# Altium project MSWC.PrjPcb
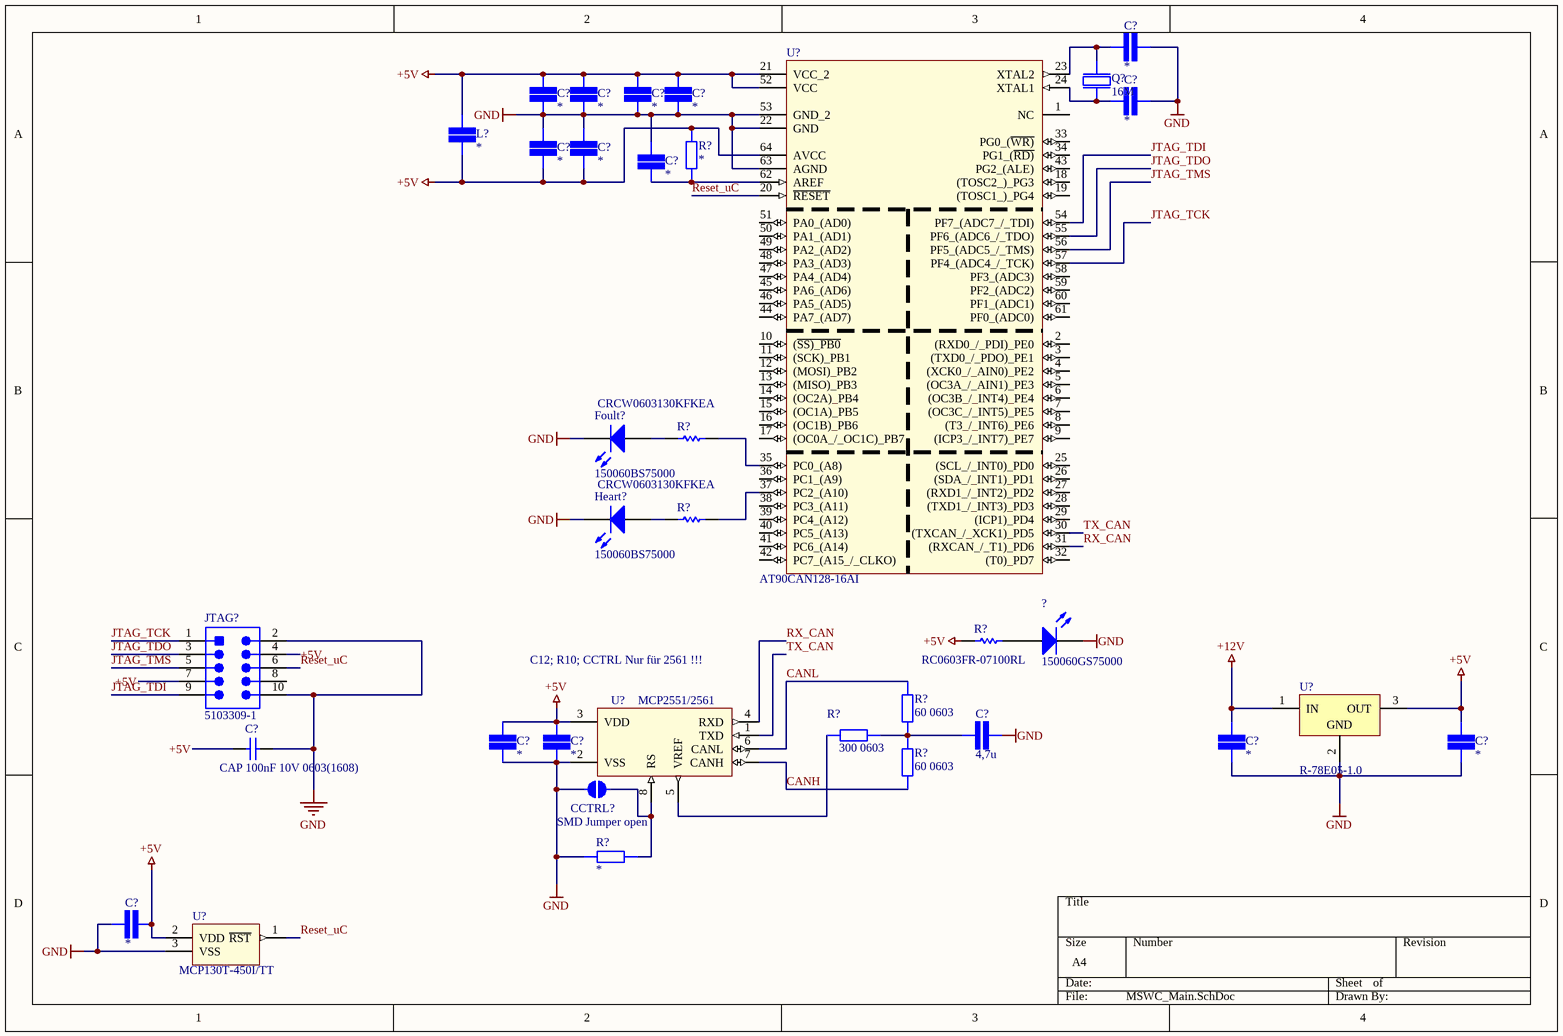
[diagram p0: MSWC_Main.SchDoc]
4 sheets, 49 parts. Net scope: global (net labels, ports and power ports of the same name join across sheets).
Sheets:
  MSWC_Main.SchDoc
  MSWC_Hub.SchDoc
  MSWC_Top.SchDoc
  MSWC_Bottom.SchDoc

## Sheet MSWC_Main.SchDoc
size A4

### Parts
(Parts that share a designator on the sheet are numbered #1, #2 ... from top to bottom, then left to right.)
?  150060GS75000  [0603_A]
C?#1  SMD Capacitor  [CAP 0603/1608]  (value not drawn)
C?#2  SMD Capacitor  [CAP 0603/1608]  (value not drawn)
C?#3  SMD Capacitor  [CAP 0603/1608]  (value not drawn)
C?#4  SMD Capacitor  [CAP 0603/1608]  (value not drawn)
C?#5  SMD Capacitor  [CAP 0603/1608]  (value not drawn)
C?#6  SMD Capacitor  [CAP 0603/1608]  (value not drawn)
C?#7  SMD Capacitor  [CAP 0603/1608]  (value not drawn)
C?#8  SMD Capacitor  [CAP 0603/1608]  (value not drawn)
C?#9  SMD Capacitor  [CAP 0603/1608]  (value not drawn)
C?#10  CAP 100nF 10V 0603(1608)  [CAPC0603(1608)100_L]
C?#11  value 4,7u  [CAP 0603/1608]  (hidden comment: SMD Capacitor)
C?#12  SMD Capacitor  [CAP 0603/1608]  (value not drawn)
C?#13  SMD Capacitor  [CAP 0603/1608]  (value not drawn)
C?#14  SMD Capacitor  [CAP 0603/1608]  (value not drawn)
C?#15  SMD Capacitor  [CAP 0603/1608]  (value not drawn)
C?#16  SMD Capacitor  [CAP 0603/1608]  (value not drawn)
CCTRL?  SMD Jumper open  [SMD-JUMPER-OPEN]  (no BOM)
Foult?  150060BS75000  [0603_A]
Heart?  150060BS75000  [0603_A]
JTAG?  5103309-1  [TECO-5103309-1_V]
L?  SMD Capacitor  [CAP 0603/1608]  (value not drawn)
Q?  16M  [NDK NX5032GA]
R?#1  SMD Resistor  [STACKPOLE CSR0603]  (value not drawn)
R?#2  CRCW0603130KFKEA  [RESC1609X50X30NL10T20]
R?#3  CRCW0603130KFKEA  [RESC1609X50X30NL10T20]
R?#4  RC0603FR-07100RL  [RESC1608X55X25ML10T15]
R?#5  value 60 0603  [STACKPOLE CSR0603]  (hidden comment: SMD Resistor)
R?#6  value 300 0603  [STACKPOLE CSR0603]  (hidden comment: SMD Resistor)
R?#7  value 60 0603  [STACKPOLE CSR0603]  (hidden comment: SMD Resistor)
R?#8  SMD Resistor  [STACKPOLE CSR0603]  (value not drawn)
U?#1  AT90CAN128-16AI  [*QFP80P1600X1600X120-64N]
U?#2  R-78E05-1.0  [SIP3_RECOM]
U?#3  MCP2551/2561  [*SOIC127P600X175-8N]
U?#4  MCP130T-450I/TT  [*SOT95P237X112-3N]

### Nets
+5V: C?#2.2 C?#3.2 C?#4.2 C?#5.2 C?#7.1 C?#8.1 C?#10.1 C?#12.2 C?#13.2 C?#15.2 C?#16.1 JTAG?.4 JTAG?.7 L?.1 L?.2 R?#1.2 R?#4.1 U?#1.21(VCC_2) U?#1.52(VCC) U?#1.64(AVCC) U?#2.3(OUT) U?#3.3(VDD) U?#4.2(VDD)
+12V: C?#14.2 U?#2.1(IN)
GND: ?.1(K) C?#1.1 C?#2.1 C?#3.1 C?#4.1 C?#5.1 C?#6.1 C?#7.2 C?#8.2 C?#9.2 C?#10.2 C?#11.2 C?#12.1 C?#13.1 C?#14.1 C?#15.1 C?#16.2 CCTRL?.1 Foult?.1(K) Heart?.1(K) JTAG?.2 JTAG?.10 R?#8.1 U?#1.22(GND) U?#1.53(GND_2) U?#1.63(AGND) U?#2.2(GND) U?#3.2(VSS) U?#4.3(VSS)
CANH: R?#7.2 U?#3.7(CANH)
CANL: R?#5.1 U?#3.6(CANL)
JTAG_TCK: JTAG?.1 U?#1.57(PF4_(ADC4_/_TCK))
JTAG_TDI: JTAG?.9 U?#1.54(PF7_(ADC7_/_TDI))
JTAG_TDO: JTAG?.3 U?#1.55(PF6_(ADC6_/_TDO))
JTAG_TMS: JTAG?.5 U?#1.56(PF5_(ADC5_/_TMS))
Reset_uC: JTAG?.6 U?#1.20(~{RESET}) U?#4.1(~{RST})
RX_CAN: U?#1.31((RXCAN_/_T1)_PD6) U?#3.4(RXD)
TX_CAN: U?#1.30((TXCAN_/_XCK1)_PD5) U?#3.1(TXD)
Net?_2: ?.2(A) R?#4.2
NetC?#1_2: C?#1.2 Q?.2 U?#1.23(XTAL2)
NetC?#6_2: C?#6.2 Q?.1 U?#1.24(XTAL1)
NetC?#9_1: C?#9.1 R?#1.1 U?#1.62(AREF)
NetC?#11_1: C?#11.1 R?#5.2 R?#6.2 R?#7.1
NetCCTRL?_2: CCTRL?.2 R?#8.2 U?#3.8(RS)
NetFoult?_2: Foult?.2(A) R?#2.2
NetHeart?_2: Heart?.2(A) R?#3.2
NetR?#2_1: R?#2.1 U?#1.35(PC0_(A8))
NetR?#3_1: R?#3.1 U?#1.37(PC2_(A10))
NetR?#6_1: R?#6.1 U?#3.5(VREF)

Not connected (* = marked no-connect by the designer): JTAG? 8; U?#1 1(NC) 2((RXD0_/_PDI)_PE0) 3((TXD0_/_PDO)_PE1) 4((XCK0_/_AIN0)_PE2) 5((OC3A_/_AIN1)_PE3) 6((OC3B_/_INT4)_PE4) 7((OC3C_/_INT5)_PE5) 8((T3_/_INT6)_PE6) 9((ICP3_/_INT7)_PE7) 10((~{SS)_PB0}) 11((SCK)_PB1) 12((MOSI)_PB2) 13((MISO)_PB3) 14((OC2A)_PB4) 15((OC1A)_PB5) 16((OC1B)_PB6) 17((OC0A_/_OC1C)_PB7) 18((TOSC2_)_PG3) 19((TOSC1_)_PG4) 25((SCL_/_INT0)_PD0) 26((SDA_/_INT1)_PD1) 27((RXD1_/_INT2)_PD2) 28((TXD1_/_INT3)_PD3) 29((ICP1)_PD4) 32((T0)_PD7) 33(PG0_(~{WR)}) 34(PG1_(~{RD)}) 36(PC1_(A9)) 38(PC3_(A11)) 39(PC4_(A12)) 40(PC5_(A13)) 41(PC6_(A14)) 42(PC7_(A15_/_CLKO)) 43(PG2_(ALE)) 44(PA7_(AD7)) 45(PA6_(AD6)) 46(PA5_(AD5)) 47(PA4_(AD4)) 48(PA3_(AD3)) 49(PA2_(AD2)) 50(PA1_(AD1)) 51(PA0_(AD0)) 58(PF3_(ADC3)) 59(PF2_(ADC2)) 60(PF1_(ADC1)) 61(PF0_(ADC0))

### Notes on the sheet
- C12; R10; CCTRL Nur für 2561 !!!

### Library data of the parts
? = CMP-1426-00002-1: SMD mono-color Chip LED, WL-SMCW, Green; Manufacturer: Wuerth Elektronik; ComponentLink1URL: http://www.we-online.com; ComponentLink2Description: Datasheet; Color: Green; ComponentLink2URL: http://katalog.we-online.com/led/datasheet/150060GS75000.pdf; PartNumber: 150060GS75000; PackageReference: 0603_A; ComponentLink1Description: Manufacturer URL
C?#1-C?#9 C?#11-C?#16 L? = SMD Capacitor: Capacitor with multiple Footprints
  C?#1-C?#9 C?#12-C?#16 L?: Value: *
C?#10 = CMP-1035-02579-1: CAP 100nF 10V ±5% 0603 (1608 Metric) Thickness 1mm SMD; Tolerance: Â±5%; Case-EIA: 0603; Case-Metric: 1608; Value: 100nF; Max Thickness: 1 mm; Rated Voltage: 10 V; Technology: SMT
Foult? Heart? = CMP-1426-00003-1: SMD mono-color Chip LED, WL-SMCW, Blue; Manufacturer: Wuerth Elektronik; Color: Blue; ComponentLink2Description: Datasheet; ComponentLink2URL: http://katalog.we-online.com/led/datasheet/150060BS75000.pdf; ComponentLink1URL: http://www.we-online.com; PackageReference: 0603_A; PartNumber: 150060BS75000; ComponentLink1Description: Manufacturer URL
JTAG? = CMP-2000-07502-1: Male Header, Pitch 2.54 mm, 2 x 5 Position, Height 9.855 mm, Tail Length 3.048 mm, -65 to 105 degC, RoHS, Tube; Manufacturer: TE Connectivity; PCB Mounting Orientation: Vertical; Pitch: 2.54mm; Mating Connector Lock: No(Without); Body Material: Thermoplastic; Shrouded: Yes(With); Connector System: Wire-to-Board; Insulation Resistance: 5GR; Number of Positions: 10; Max Current Rating: 1A; PCB Mount Retention: Without; Manufacturer URL: http://www.te.com/; Contact Plating: Gold; Datasheet URL: http://www.te.com/commerce/DocumentDelivery/DDEController?Action=showdoc&DocId=Customer+Drawing%7F5103309%7FE1%7Fpdf%7FEnglish%7FENG_CD_5103309_E1.pdf%7F5103309-1; Colour: Black; Termination: ThroughHole; Housing Colour: Black; Flammability Rating: UL94V-0; Package Description: Male Header, Pitch 2.54 mm, 2 x 5 Position, Height 9.855 mm, Tail Length 3.048 mm; Mating Retention: No(Without); Orientation: Straight; Row Spacing: 2.54mm; Termination Post Length: 0.12inch; Min Operating Temperature: -65degC; Board Standoff: Yes(With); REACH SVHC: NoSVHC; Depth: 9.14mm; Lead Free: LeadFree; Gender: Male; Connector Type: Header; Shrouded End Dimension: 3.81mm; ELV: Compliant; Mating Alignment: Yes(With); Panel Mount Retention: No(Without); Package Quantity: 35; PCB Mount Alignment: No(Without); Number of Rows: 2; Package Reference: 5103309-1; Mounting Technology: ThroughHole; Mount: ThroughHole; Contact Gender: Male; Number of Contacts: 10; Length: 0.8inch; Current Rating: 1A; Contact Mating Length: 0.24inch; Max Operating Temperature: 105degC; RoHSCompliant: True; Datasheet Version: Rev. E1, 03/2011; Contact Shape: Square; Height: 8.813mm; Housing Material: PBT; Contact Material: CopperAlloy; Packaging: Rail/Tube
Q? = 16 MHz Quartz
R?#1 R?#5-R?#8 = SMD Resistor: Resistor with multiple footprints
  R?#1 R?#8: Value: *
R?#2 R?#3 = CMP-2000-03887-1: Manufacturer: Vishay Dale; Part Number: CRCW0603130KFKEA
R?#4 = CMP-2100-03663-1: Chip Resistor, 100 Ohm, +/- 1%, 0.1 W, -55 to 155 degC, 0603 (1608 Metric), RoHS, Tape and Reel; Manufacturer: Yageo; Voltage Rating (DC): 50V; Power Rating: 100mW; Resistance: 100Ohm; Temperature Coefficient: 100ppm/degreesC; Number of Pins: 2; Tolerance: 1%; Height: 0.45mm; Manufacturer URL: http://www.yageo.com/; Military Standard: Not; Datasheet URL: http://www.yageo.com/NewPortal/yageodocoutput?fileName=/pdf/R-Chip/PYu-RC_Group_51_RoHS_L_5.pdf; Case Code (Imperial): 0603; Termination: SMD/SMT; Lead Free: LeadFree; Max Operating Temperature: 155degC; Case Code (Metric): 1608; RoHSCompliant: true; Voltage Rating: 50V; Width: 0.8mm; Composition: ThickFilm; Depth: 0.8mm; REACH SVHC: Unknown; Min Operating Temperature: -55degC; Packaging: TapeandReel; Package Description: 2-Pin Surface Mount Device, Body 1.6 x 0.8 mm; Length: 1.6mm; Package Reference: 0603; Datasheet Version: Rev. 5, 10/2016; Case/Package: 0603
U?#1 = AT90CAN128-16AI: Ic Mcu 8bit 128kb Flash 64tqfp; MF: Microchip; MP: AT90CAN128-16AI; Package: TQFP-64 Microchip; SnapEDA_Link: https://www.snapeda.com/parts/AT90CAN128-16AI/Microchip/view-part/?ref=snap; Price: None; Availability: Unavailable; Value: *
U?#2 = R-78E05-1.0: Nonisolated 5V Switchmode converter
U?#3 = MCP2551-I/SN: MCP2551 Series 5.5 V 1 Mb/s Surface Mount High-Speed CAN Transceiver - SOIC-8; MF: Microchip; MP: MCP2551-I/SN; SnapEDA_Link: https://www.snapeda.com/parts/MCP2551-I/SN/Microchip/view-part/?ref=snap; Price: None; Package: SOIC-8 Microchip; Availability: Unavailable; Value: *
U?#4 = MCP130T-450I/TT: System Supervisors - Power Supply Monitors with Reset Generators Open Drain Low; MF: Microchip; MP: MCP120T-450I/TT; Price: None; SnapEDA_Link: https://www.snapeda.com/parts/MCP120T-450I/TT/Microchip/view-part/?ref=snap; Package: SOT-23-3 Microchip; Availability: Unavailable; Value: *

## Sheet MSWC_Hub.SchDoc
size A4

## Sheet MSWC_Top.SchDoc
size A4
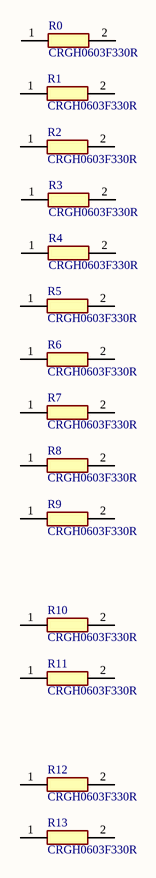
[diagram p1: MSWC_Top.SchDoc]

### Parts
R0  CRGH0603F330R  [RESC1608X55N]
R1  CRGH0603F330R  [RESC1608X55N]
R2  CRGH0603F330R  [RESC1608X55N]
R3  CRGH0603F330R  [RESC1608X55N]
R4  CRGH0603F330R  [RESC1608X55N]
R5  CRGH0603F330R  [RESC1608X55N]
R6  CRGH0603F330R  [RESC1608X55N]
R7  CRGH0603F330R  [RESC1608X55N]
R8  CRGH0603F330R  [RESC1608X55N]
R9  CRGH0603F330R  [RESC1608X55N]
R10  CRGH0603F330R  [RESC1608X55N]
R11  CRGH0603F330R  [RESC1608X55N]
R12  CRGH0603F330R  [RESC1608X55N]
R13  CRGH0603F330R  [RESC1608X55N]

### Nets

Not connected (* = marked no-connect by the designer): R0 1 2; R1 1 2; R2 1 2; R3 1 2; R4 1 2; R5 1 2; R6 1 2; R7 1 2; R8 1 2; R9 1 2; R10 1 2; R11 1 2; R12 1 2; R13 1 2

### Library data of the parts
R0-R13 = CRGH0603F330R: Resistor; Manufacturer_Name: TE Connectivity; Height: 0.55mm; Manufacturer_Part_Number: CRGH0603F330R

## Sheet MSWC_Bottom.SchDoc
size A4